# EAGLE schematic NINJA-001 (EAGLE 9.6.1)
CNAME: ADOSIA IoT - Open Hardware Design; CREVISION: Rev: v3.1; DESIGNER: ENGINEER: adosiawolf; DESIGN_NAME: Capacitive Analog Soil Moisture Sensor - Adosia NINJA; MODIFY_DATE: Updated: 05-15-2020
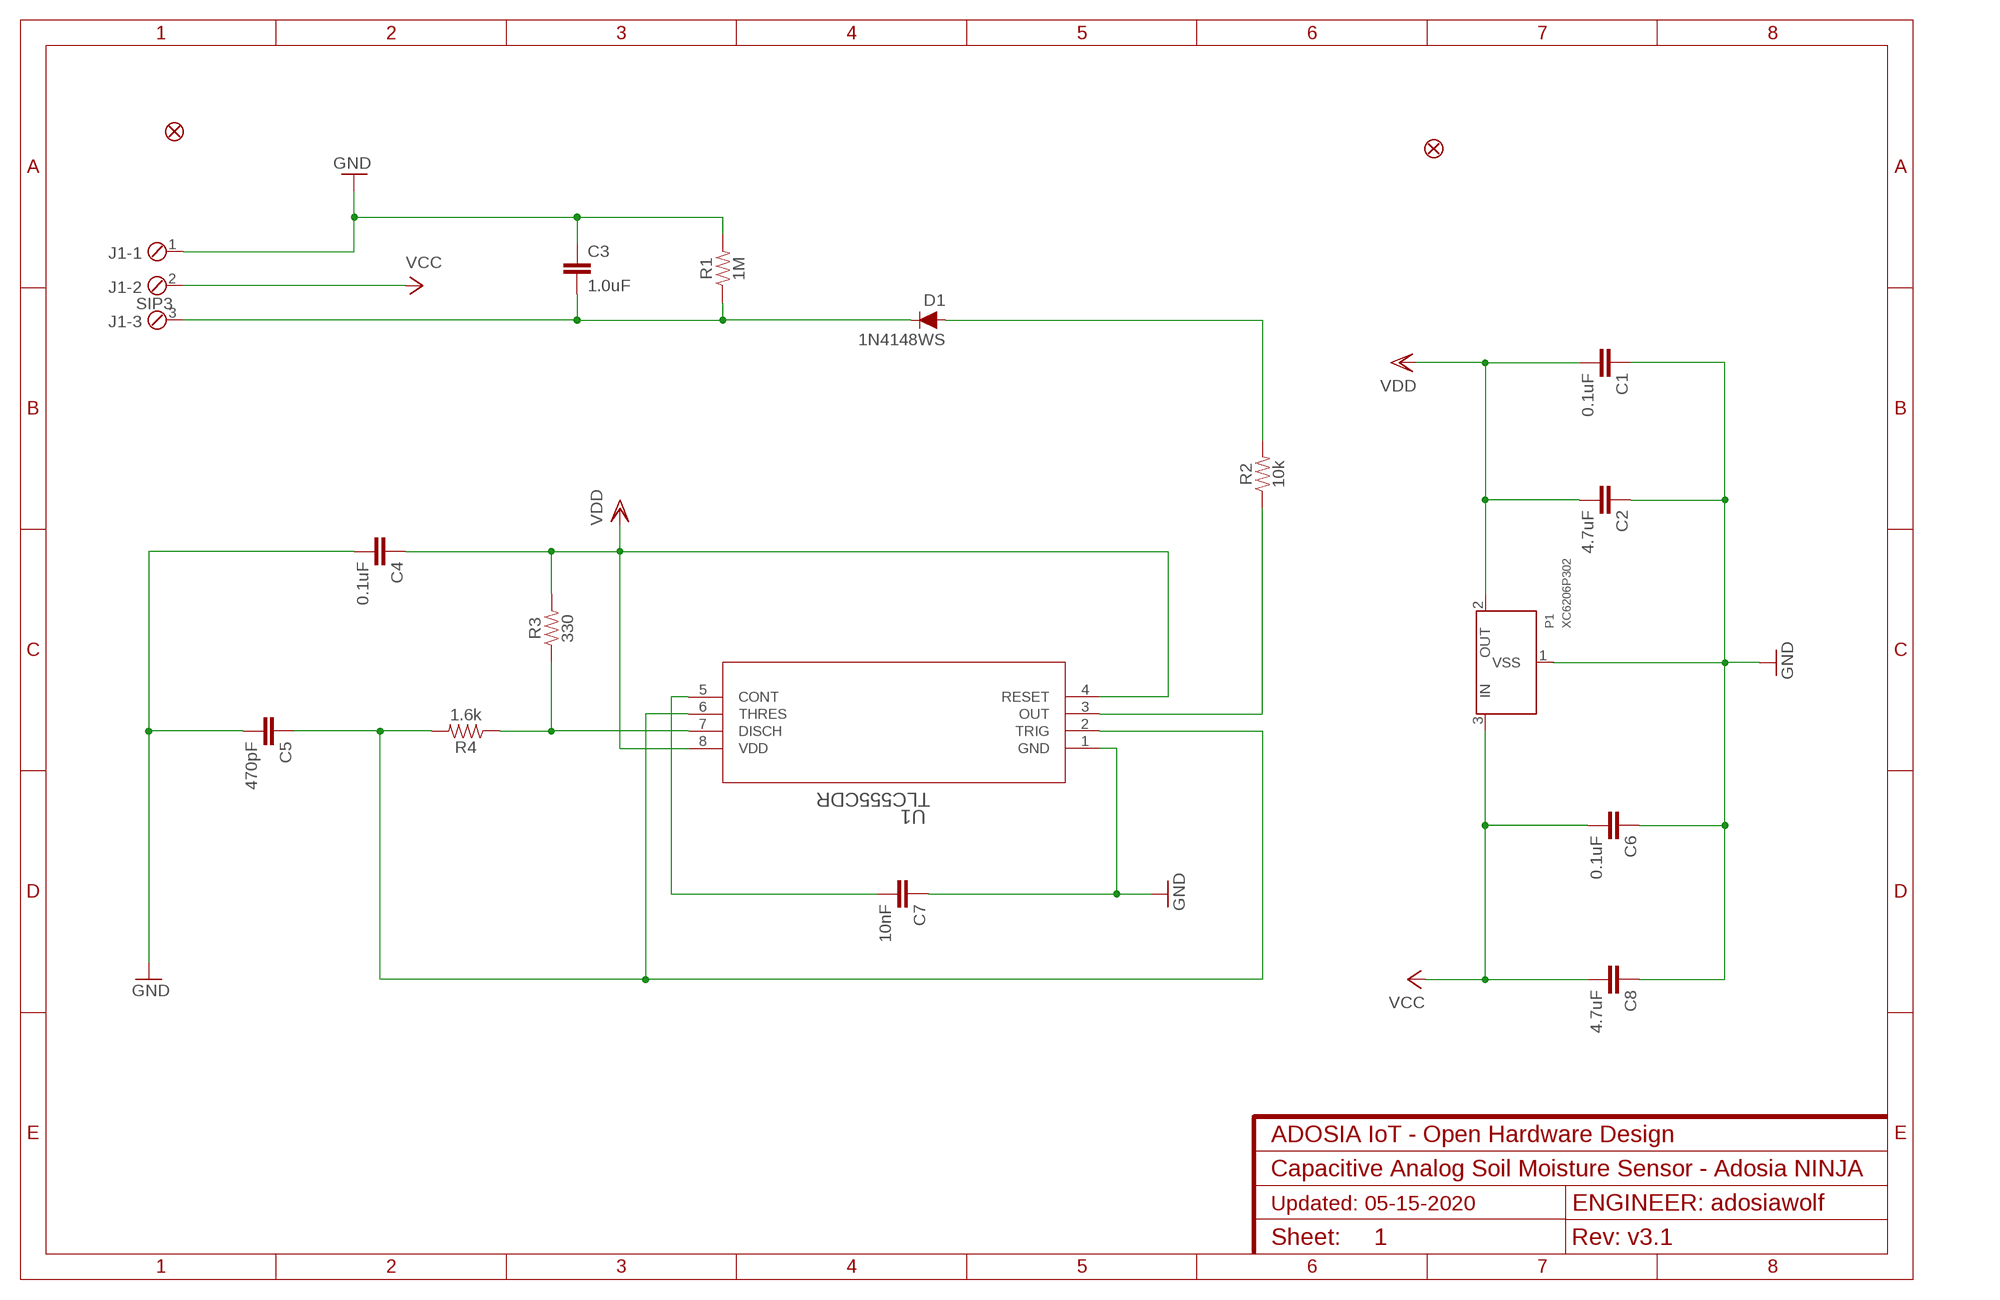
[diagram p0: schematic, sheet 1]

## Parts
C1  0.1uF  0.1UF-0603-25V-5%  [0603]
C2  4.7uF  4.7UF0603  [0603]
C3  1.0uF  1.0UF-0603-16V-10%  [0603]
C4  0.1uF  0.1UF-0603-25V-5%  [0603]
C5  470pF  470PF-0603-50V-5%  [0603]
C6  0.1uF  0.1UF-0603-25V-5%  [0603]
C7  10nF  10NF-0603-50V-10%  [0603]
C8  4.7uF  4.7UF0603  [0603]
D1  1N4148WS  DIODE-BAS16J  [SOD-323]
FD1  FIDUCIAL1X2  [FIDUCIAL-1X2]
FD2  FIDUCIAL1X2  [FIDUCIAL-1X2]
J1  SIP3  MPT3  [3POL254]
P1  XC6206P302  XC6206SOT-23  [XC6206_SOT-23]
R1  1M  1MOHM-0603-1/4W-5%  [0603]
R2  10k  10KOHM-0603-1/10W-1%  [0603]
R3  330  330OHM-0603-1/10W-1%  [0603]
R4  1.6k  1.6KOHM-0603-1/10W-1%  [0603]
U1  TLC555CDR  [D8]

## Nets
A: C3.2 D1.C J1.3 R1.1
GND: C1.1 C2.1 C3.1 C4.2 C5.2 C6.1 C7.1 C8.1 J1.1 P1.1(VSS) R1.2 U1.1(GND)
N$1: R2.1 U1.3(OUT)
N$3: D1.A R2.2
N$4: R3.1 R4.1 U1.7(DISCH)
N$5: C7.2 U1.5(CONT)
N$6: C5.1 R4.2 U1.2(TRIG) U1.6(THRES)
VCC: C6.2 C8.2 J1.2 P1.3(IN)
VDD: C1.2 C2.2 C4.1 P1.2(OUT) R3.2 U1.4(RESET) U1.8(VDD)

## Library data of the parts
C1 C4 C6 = SparkFun-Capacitors:0.1UF: 0.1µF ceramic capacitors A capacitor is a passive two-terminal electrical component used to store electrical energy temporarily in an electric field.; PROD_ID: CAP-08604
C2 C8 = SparkFun-Capacitors:4.7UF: 4.7µF ceramic capacitors A capacitor is a passive two-terminal electrical component used to store electrical energy temporarily in an electric field.; PROD_ID: CAP-08280
C3 = SparkFun-Capacitors:1.0UF: 1µF ceramic capacitors A capacitor is a passive two-terminal electrical component used to store electrical energy temporarily in an electric field.; PROD_ID: CAP-00868
C5 = SparkFun-Capacitors:470PF: 470pF ceramic capacitors A capacitor is a passive two-terminal electrical component used to store electrical energy temporarily in an electric field.; PROD_ID: CAP-07884
C7 = SparkFun-Capacitors:10NF: 0.01uF/10nF/10,000pF ceramic capacitors A capacitor is a passive two-terminal electrical component used to store electrical energy temporarily in an electric field. CAP-09321; PROD_ID: CAP-00867
D1 = SparkFun-DiscreteSemi:DIODE: Diode These are standard reverse protection diodes and small signal diodes. SparkFun Products: SparkFun SparkPunk Sound Kit <https://www.sparkfun.com/products/11177> SparkFun ESP8266 Thing <https://www.sparkfun.com/products/13231>; PROD_ID: DIO-09646; VALUE: 250mA/100V
FD1 FD2 = SparkFun-Aesthetics:FIDUCIAL: Fiducial Alignment Points Point-of-reference for pick-and-place machines and other optical instruments.
J1 = con-phoenix-254:MPT3: PHOENIX CONNECTOR; OC_FARNELL: unknown; OC_NEWARK: unknown
P1 = Voltage-Regulator-Custom:XC6206: XC6206P , linear regulator. Producted by TOREX.Co Store Information: EXCEL device corporation http://www.excel-d.com/access/index.html
R1 = SparkFun-Resistors:1MOHM: 1MΩ resistor A resistor is a passive two-terminal electrical component that implements electrical resistance as a circuit element. Resistors act to reduce current flow, and, at the same time, act to lower voltage levels within circuits. - Wikipedia; PROD_ID: RES-07868
R2 = SparkFun-Resistors:10KOHM: 10kΩ resistor A resistor is a passive two-terminal electrical component that implements electrical resistance as a circuit element. Resistors act to reduce current flow, and, at the same time, act to lower voltage levels within circuits. - Wikipedia; PROD_ID: RES-00824
R3 = SparkFun-Resistors:330OHM: 330Ω resistor A resistor is a passive two-terminal electrical component that implements electrical resistance as a circuit element. Resistors act to reduce current flow, and, at the same time, act to lower voltage levels within circuits. - Wikipedia; PROD_ID: RES-00818
R4 = SparkFun-Resistors:1.6KOHM: 1.6kΩ resistor A resistor is a passive two-terminal electrical component that implements electrical resistance as a circuit element. Resistors act to reduce current flow, and, at the same time, act to lower voltage levels within circuits. - Wikipedia; PROD_ID: RES-08361
U1 = TLC555CDR:TLC555CDR; MANUFACTURER_PART_NUMBER: TLC555CDR; VENDOR: Texas Instruments